# Altium project Laser MCU.PrjPcb (part 4 of 4)

## Sheet Communication.SchDoc
size 431 x 279 mm; Organization: ORGANIZATION; Address1: 207; Address2: 13399 104 Ave; Address3: Surrey BC, V3T 0C9; Address4: Canada; Revision: V0.0.0; SheetNumber: 5; SheetTotal: 5; ENG_APP_DATE: --/--/--; DSN_APP_DATE: --/--/--; CHK_APP_DATE: --/--/--
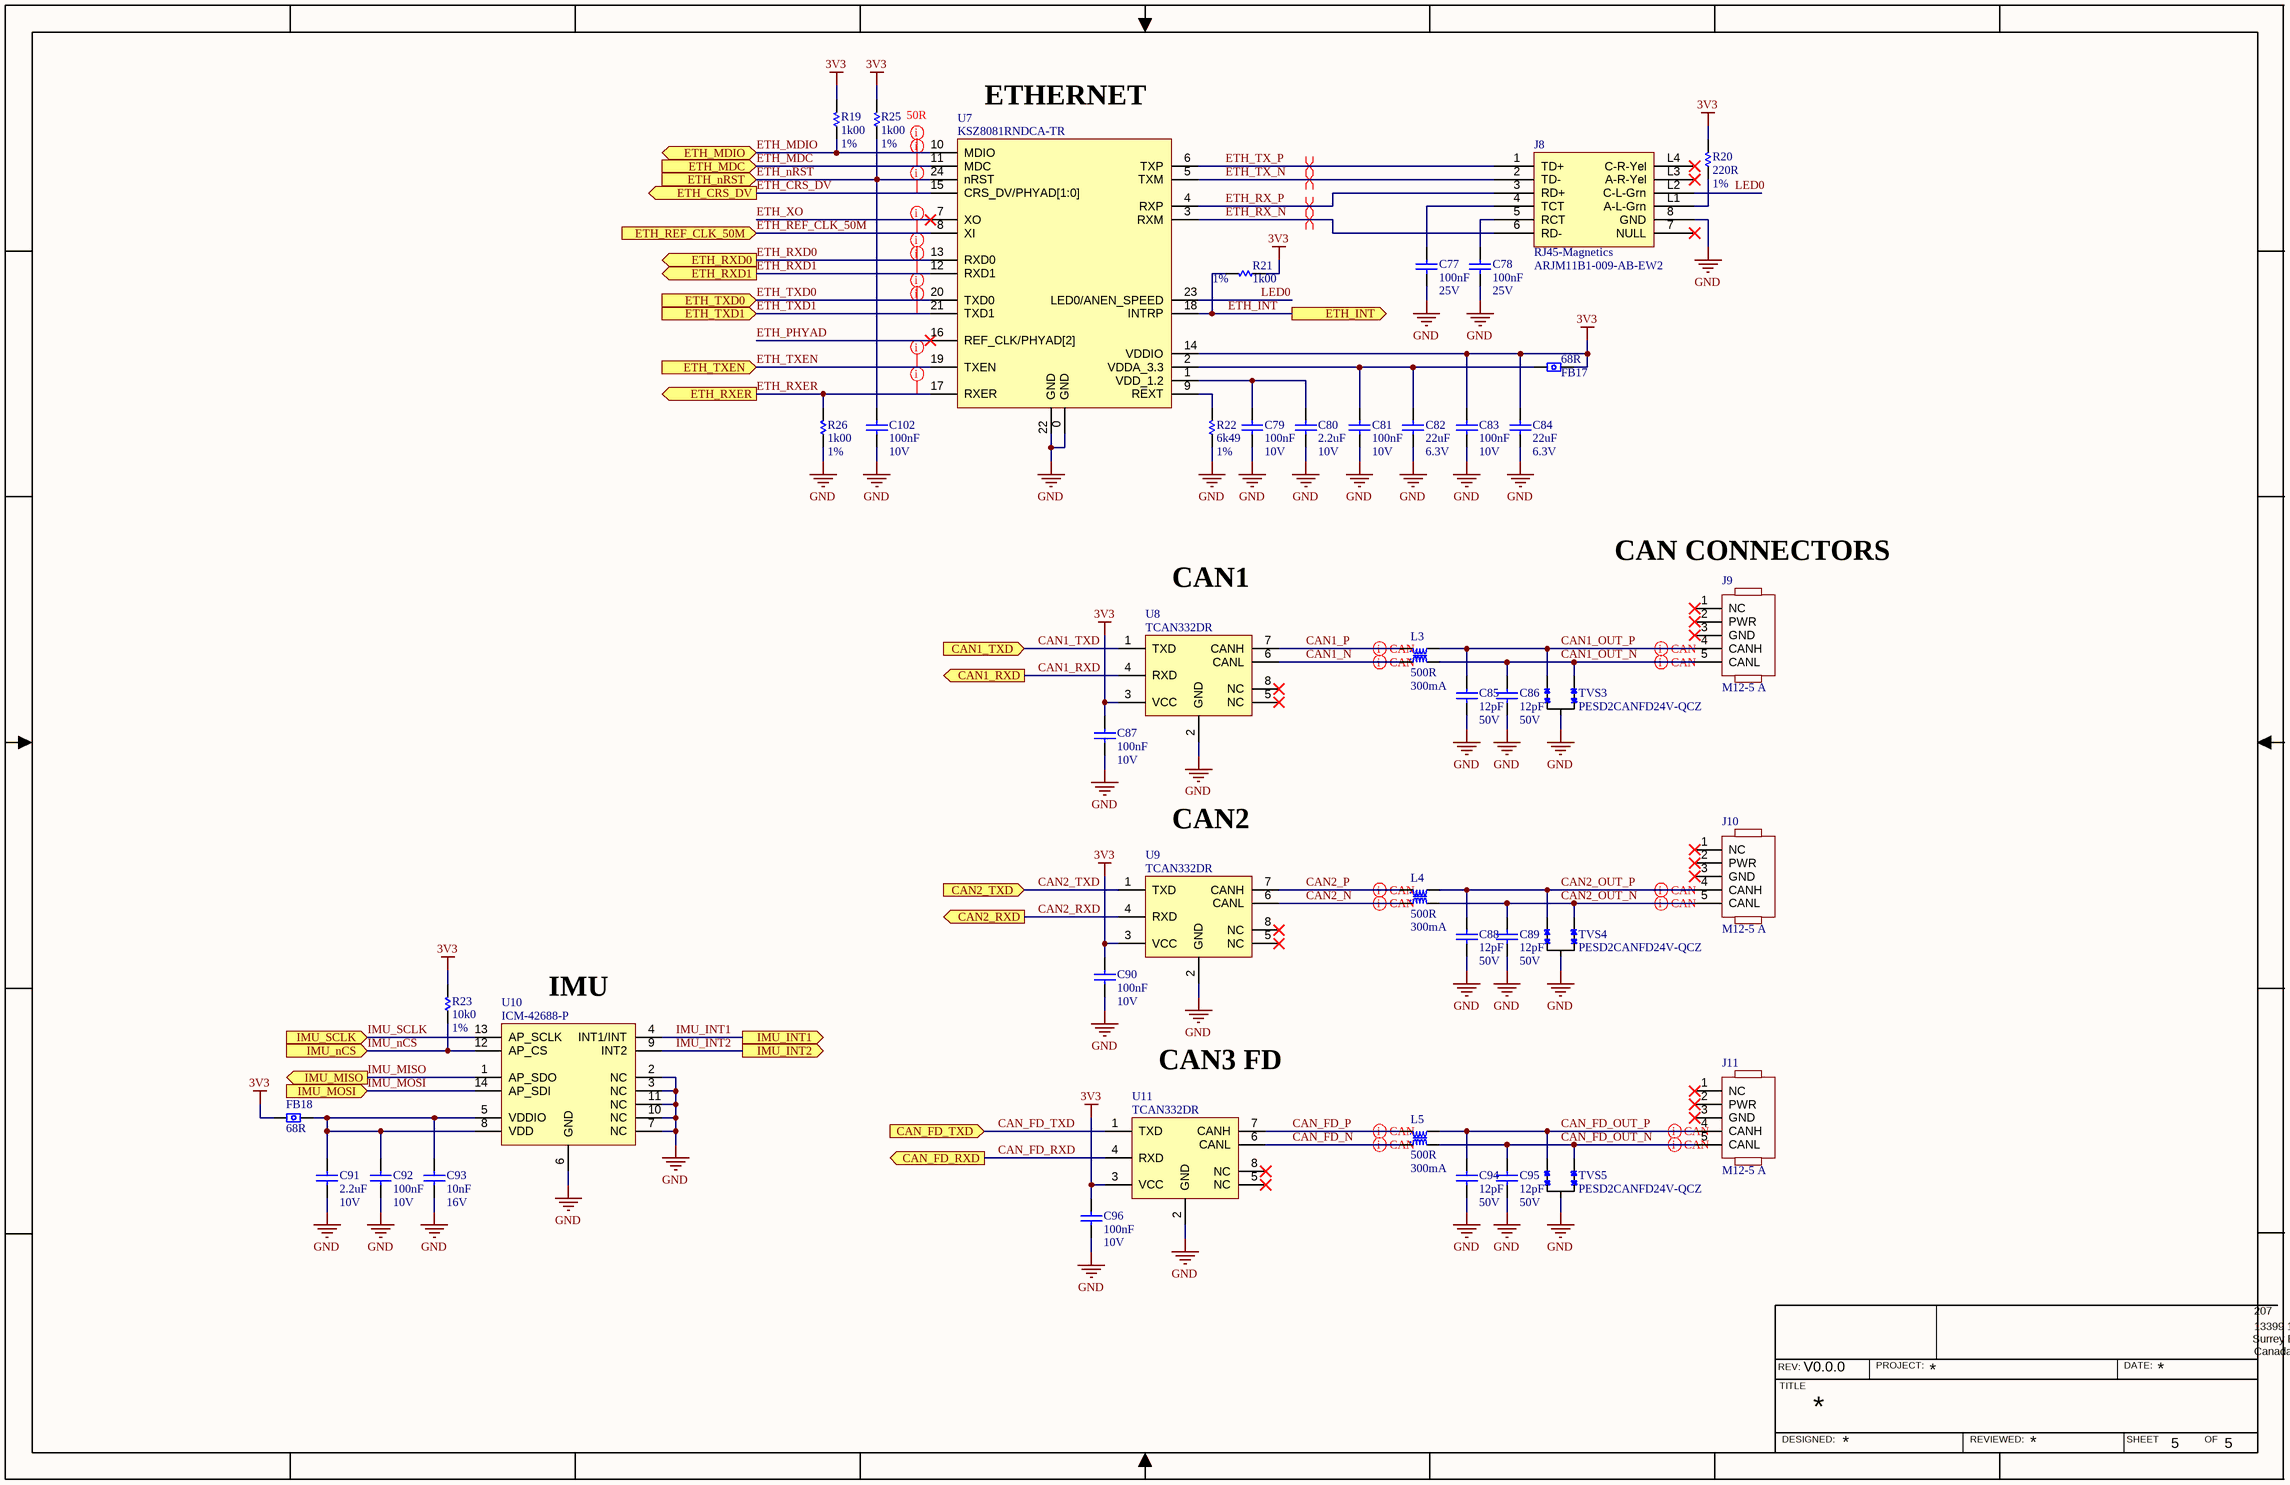
[diagram p4: Communication.SchDoc]

### Parts
C77  100nF  Voltage Rating: 25V  [C0402]
C78  100nF  Voltage Rating: 25V  [C0402]
C79  100nF  Voltage Rating: 10V  [C0201]
C80  2.2uF  Voltage Rating: 10V  [C0402]
C81  100nF  Voltage Rating: 10V  [C0201]
C82  22uF  Voltage Rating (DC): 6.3V  [C0805]
C83  100nF  Voltage Rating: 10V  [C0201]
C84  22uF  Voltage Rating (DC): 6.3V  [C0805]
C85  12pF  Voltage: 50V  [C0402]
C86  12pF  Voltage: 50V  [C0402]
C87  100nF  Voltage Rating: 10V  [C0201]
C88  12pF  Voltage: 50V  [C0402]
C89  12pF  Voltage: 50V  [C0402]
C90  100nF  Voltage Rating: 10V  [C0201]
C91  2.2uF  Voltage Rating: 10V  [C0402]
C92  100nF  Voltage Rating: 10V  [C0201]
C93  10nF  Voltage Rating: 16V  [c0402]
C94  12pF  Voltage: 50V  [C0402]
C95  12pF  Voltage: 50V  [C0402]
C96  100nF  Voltage Rating: 10V  [C0201]
C102  100nF  Voltage Rating: 10V  [C0201]
FB17  68R  [FB0402]
FB18  68R  [FB0402]
J8  RJ45-Magnetics  [RJ45_ARJM11B1_LED]
J9  M12-5 A  [M12-5A RA TH]
J10  M12-5 A  [M12-5A RA TH]
J11  M12-5 A  [M12-5A RA TH]
L3  500R  Max Current Rating: 300mA  [IND CHOKE 1.2x2]
L4  500R  Max Current Rating: 300mA  [IND CHOKE 1.2x2]
L5  500R  Max Current Rating: 300mA  [IND CHOKE 1.2x2]
R19  1k00  Tolerance: 1%  [R0402]
R20  220R  Tolerance: 1%  [R0402]
R21  1k00  Tolerance: 1%  [R0402]
R22  6k49  Tolerance: 1%  [r0402]
R23  10k0  Tolerance: 1%  [r0402]
R25  1k00  Tolerance: 1%  [R0402]
R26  1k00  Tolerance: 1%  [R0402]
TVS3  PESD2CANFD24V-QCZ  [DFN1412D-3]
TVS4  PESD2CANFD24V-QCZ  [DFN1412D-3]
TVS5  PESD2CANFD24V-QCZ  [DFN1412D-3]
U7  KSZ8081RNDCA-TR  [QFN50P400X400X90_HS-25N]
U8  TCAN332DR  [SO8 6.2x5mm TI D0008A]
U9  TCAN332DR  [SO8 6.2x5mm TI D0008A]
U10  ICM-42688-P  [PQFN50P300X250X97-14 ICM-42688-P]
U11  TCAN332DR  [SO8 6.2x5mm TI D0008A]

### Ports
CAN1_RXD (out), CAN1_TXD (in), CAN2_RXD (out), CAN2_TXD (in), CAN_FD_RXD (out), CAN_FD_TXD (in), ETH_CRS_DV (out), ETH_INT (out), ETH_MDC (in), ETH_MDIO (bidir), ETH_nRST (in), ETH_REF_CLK_50M (in), ETH_RXD0 (out), ETH_RXD1 (out), ETH_RXER (out), ETH_TXD0 (in), ETH_TXD1 (in), ETH_TXEN (in), IMU_INT1 (out), IMU_INT2 (out), IMU_MISO (out), IMU_MOSI (in), IMU_nCS (in), IMU_SCLK (in)

### Nets
3V3: C83.2 C84.2 C87.2 C90.2 C96.2 FB17.1 FB18.1 R19.2 R20.2 R21.1 R23.2 R25.2 U7.14(VDDIO) U8.3(VCC) U9.3(VCC) U11.3(VCC)
GND: C77.1 C78.1 C79.1 C80.1 C81.1 C82.1 C83.1 C84.1 C85.1 C86.1 C87.1 C88.1 C89.1 C90.1 C91.1 C92.1 C93.1 C94.1 C95.1 C96.1 C102.1 J8.8(GND) R22.1 R26.1 TVS3.3 TVS4.3 TVS5.3 U7.0(GND) U7.22(GND) U8.2(GND) U9.2(GND) U10.2(NC) U10.3(NC) U10.6(GND) U10.7(NC) U10.10(NC) U10.11(NC) U11.2(GND)
CAN1_N: L3.4 U8.6(CANL)
CAN1_OUT_N: C86.2 J9.5(CANL) L3.3 TVS3.2
CAN1_OUT_P: C85.2 J9.4(CANH) L3.2 TVS3.1
CAN1_P: L3.1 U8.7(CANH)
CAN1_RXD: U8.4(RXD) ; port CAN1_RXD
CAN1_TXD: U8.1(TXD) ; port CAN1_TXD
CAN2_N: L4.4 U9.6(CANL)
CAN2_OUT_N: C89.2 J10.5(CANL) L4.3 TVS4.2
CAN2_OUT_P: C88.2 J10.4(CANH) L4.2 TVS4.1
CAN2_P: L4.1 U9.7(CANH)
CAN2_RXD: U9.4(RXD) ; port CAN2_RXD
CAN2_TXD: U9.1(TXD) ; port CAN2_TXD
CAN_FD_N: L5.4 U11.6(CANL)
CAN_FD_OUT_N: C95.2 J11.5(CANL) L5.3 TVS5.2
CAN_FD_OUT_P: C94.2 J11.4(CANH) L5.2 TVS5.1
CAN_FD_P: L5.1 U11.7(CANH)
CAN_FD_RXD: U11.4(RXD) ; port CAN_FD_RXD
CAN_FD_TXD: U11.1(TXD) ; port CAN_FD_TXD
ETH_CRS_DV: U7.15(CRS_DV/PHYAD[1:0]) ; port ETH_CRS_DV
ETH_INT: R21.2 U7.18(INTRP) ; port ETH_INT
ETH_MDC: U7.11(MDC) ; port ETH_MDC
ETH_MDIO: R19.1 U7.10(MDIO) ; port ETH_MDIO
ETH_nRST: C102.2 R25.1 U7.24(nRST) ; port ETH_nRST
ETH_PHYAD: U7.16(REF_CLK/PHYAD[2])
ETH_REF_CLK_50M: U7.8(XI) ; port ETH_REF_CLK_50M
ETH_RX_N: J8.6(RD-) U7.3(RXM)
ETH_RX_P: J8.3(RD+) U7.4(RXP)
ETH_RXD0: U7.13(RXD0) ; port ETH_RXD0
ETH_RXD1: U7.12(RXD1) ; port ETH_RXD1
ETH_RXER: R26.2 U7.17(RXER) ; port ETH_RXER
ETH_TX_N: J8.2(TD-) U7.5(TXM)
ETH_TX_P: J8.1(TD+) U7.6(TXP)
ETH_TXD0: U7.20(TXD0) ; port ETH_TXD0
ETH_TXD1: U7.21(TXD1) ; port ETH_TXD1
ETH_TXEN: U7.19(TXEN) ; port ETH_TXEN
ETH_XO: U7.7(XO)
IMU_INT1: U10.4(INT1/INT) ; port IMU_INT1
IMU_INT2: U10.9(INT2) ; port IMU_INT2
IMU_MISO: U10.1(AP_SDO) ; port IMU_MISO
IMU_MOSI: U10.14(AP_SDI) ; port IMU_MOSI
IMU_nCS: R23.1 U10.12(AP_CS) ; port IMU_nCS
IMU_SCLK: U10.13(AP_SCLK) ; port IMU_SCLK
LED0: J8.L2(C-L-Grn) U7.23(LED0/ANEN_SPEED)
NetC77_2: C77.2 J8.4(TCT)
NetC78_2: C78.2 J8.5(RCT)
NetC79_2: C79.2 C80.2 U7.1(VDD_1.2)
NetC81_2: C81.2 C82.2 FB17.2 U7.2(VDDA_3.3)
NetC91_2: C91.2 C92.2 C93.2 FB18.2 U10.5(VDDIO) U10.8(VDD)
NetJ8_L1: J8.L1(A-L-Grn) R20.1
NetR22_2: R22.2 U7.9(REXT)

Not connected (* = marked no-connect by the designer): J8 7(NULL)* L3(A-R-Yel)* L4(C-R-Yel)*; J9 1(NC)* 2(PWR)* 3(GND)*; J10 1(NC)* 2(PWR)* 3(GND)*; J11 1(NC)* 2(PWR)* 3(GND)*; U8 5(NC)* 8(NC)*; U9 5(NC)* 8(NC)*; U11 5(NC)* 8(NC)*

### Layout directives
differential pair; net class CANFD: CAN_FD_N, CAN_FD_P
differential pair; net class ETH_MD; differential pair class ETH_TX; rule Matched Net Lengths [Tolerance = 50mm]; rule Matched Net Lengths [Tolerance = 0.25mm]; rule Impedance Constraint [Min = 42.50    Max = 57.50    ]; rule Impedance Constraint [Min = 85.00    Max = 115.0    ]: ETH_TX_N, ETH_TX_P
net class 50R ETH; rule Impedance Constraint [Min = 42.50    Max = 57.50    ]; rule Matched Net Lengths [Tolerance = 50mil]: ETH_CRS_DV, ETH_MDC, ETH_MDIO, ETH_RXD0, ETH_RXD1, ETH_RXER, ETH_TXD0, ETH_TXD1, ETH_TXEN
net class 50R ETH; rule Impedance Constraint [Min = 42.50    Max = 57.50    ]; rule Matched Net Lengths [Tolerance = 50mil]; rule Parallel Segment Constraint [Gap = 20mil    Limit = 1mil    Layer - Same Layer]: ETH_REF_CLK_50M
differential pair; net class ETH_MD; differential pair class ETH_RX; rule Matched Net Lengths [Tolerance = 50mm]; rule Matched Net Lengths [Tolerance = 0.25mm]; rule Impedance Constraint [Min = 42.50    Max = 57.50    ]; rule Impedance Constraint [Min = 85.00    Max = 115.0    ]: ETH_RX_N, ETH_RX_P
differential pair; net class CAN2: CAN2_N, CAN2_P
differential pair; net class CAN1: CAN1_N, CAN1_P
differential pair; net class CANFD_OUT: CAN_FD_OUT_N, CAN_FD_OUT_P
differential pair; net class CAN2_OUT: CAN2_OUT_N, CAN2_OUT_P
differential pair; net class CAN_OUT1: CAN1_OUT_N, CAN1_OUT_P

### Notes on the sheet
- (near U7) ETHERNET
- (near J9) CAN CONNECTORS
- CAN1
- CAN2
- (near U10) IMU
- CAN3 FD
- REV:
- PROJECT:
- DATE:
- TITLE
- SHEET
- OF
- DESIGNED:
- REVIEWED:

### Library data of the parts
C77 C78 = CAP CER 100nF 25V X5R 0402: Cap Ceramic 0.1uF 25V X5R 10% Pad SMD 0402 85¡ãC T/R / Multi Layer Ceramic Capacitor (MLCC); Manufacturer: Samsung; Manufacturer Part Number: CL05A104KA5NNNC; Supplier 1: Digi-Key; RoHS: Yes; Category: Ceramic Capacitors; Stock 1: 8053194; Pricing 1: 1=0.10000, 10=0.01100, 50=0.00600, 100=0.00490, 500=0.00346, 1000=0.00272, 2500=0.00248, 5000=0.00228 (USD); Mount: Surface Mount; Case/Package: 0402; Case Code (Metric): 1005; Case Code (Imperial): 0402; Min Operating Temperature: -55°C; Max Operating Temperature: 85°C; Capacitance: 100nF; Tolerance: 10%; Dielectric: X5R; Packaging: Tape and Reel; Package Quantity: 1; Voltage: 25V; Series: CL; Construction: Flat; Voltage Rating (DC): 25V; Length: 1mm; Width: 0.02inch; Height: 0.5mm; Thickness: 0.022inch; Depth: 0.5mm; Radiation Hardening: No; Lead Free: Lead Free; ComponentLink1URL: https://datasheet.ciiva.com/25802/cl05a104ka5nnnc-25802704.pdf?src-supplier=Digi-Key; ComponentLink1Description: https://datasheet.ciiva.com/25802/cl05a104ka5nnnc-25802704.pdf?src-supplier=Digi-Key; ComponentLink2URL: https://datasheet.ciiva.com/26838/getdatasheetpartid-357412-26838142.pdf?src-supplier=Verical; ComponentLink2Description: https://datasheet.ciiva.com/26838/getdatasheetpartid-357412-26838142.pdf?src-supplier=Verical; ComponentLink3URL: https://datasheet.ciiva.com/16437/cl05a104ka5nnnc-16437369.pdf?src-supplier=Future+Electronics; ComponentLink3Description: https://datasheet.ciiva.com/16437/cl05a104ka5nnnc-16437369.pdf?src-supplier=Future+Electronics; ComponentLink4URL: https://datasheet.ciiva.com/26309/mlcc-catalogdownload2013-eng-26309014.pdf?src-supplier=Distrelec; ComponentLink4Description: https://datasheet.ciiva.com/26309/mlcc-catalogdownload2013-eng-26309014.pdf?src-supplier=Distrelec; Supplier Part Number 1: 1276-1043-1-ND
C79 C81 C83 C87 C90 C92 C96 C102 = CAP CER 100nF 10V X5R 0201: CAP CER 0.1UF 10V X5R 0201; Manufacturer 1: Murata; Manufacturer Part Number 1: GRM033R61A104ME15D; Tolerance: 20%; Category 1: Ceramic Capacitors; Supplier 1: Newark; Stock 1: 345000; Pricing 1: 1=0.00300, 15000=0.00300 (USD); Case/Package: 0201; Case Code (Metric): 0603; Case Code (Imperial): 0201; Min Operating Temperature: -55°C; Max Operating Temperature: 85°C; Dielectric: X5R; Packaging: Tape and Reel; Package Quantity: 10; Series: GRM; Voltage Rating (DC): 10V; Length: 0.024inch; Width: 0.012inch; Thickness: 0.013inch; Depth: 0.3mm; Lead Free: Lead Free; ComponentLink1URL: https://datasheet.ciiva.com/131/partnumbering-e-01-131478.pdf?src-supplier=Digi-Key; ComponentLink1Description: https://datasheet.ciiva.com/131/partnumbering-e-01-131478.pdf?src-supplier=Digi-Key; ComponentLink2URL: https://datasheet.ciiva.com/131/partnumbering-e-01-131479.pdf?src-supplier=Digi-Key; ComponentLink2Description: https://datasheet.ciiva.com/131/partnumbering-e-01-131479.pdf?src-supplier=Digi-Key; Supplier Part Number 1: 65AH6960; RoHS 1: Yes; Description 1: CAP CER 0.1UF 10V X5R 0201; Mounting Technology: Surface Mount; Value: 100nF; RoHS Compliant: Yes
C80 C91 = CAP CER 2.2uF 10V X5R 0402: -; Manufacturer: Taiyo Yuden; Manufacturer Part Number: LMK105BJ225MV-F; Tolerance: 20%; Dielectric: X5R; Supplier 1: Newark; RoHS: Yes; Category: Ceramic Capacitors; Stock 1: 2002; Pricing 1: 1=0.10000, 25=0.03300, 100=0.02300, 250=0.02000, 500=0.01700, 1000=0.01500 (USD); Mount: Surface Mount; Case/Package: 0402; Case Code (Imperial): 0402; Case Code (Metric): 1005; Min Operating Temperature: -55°C; Max Operating Temperature: 85°C; Packaging: Tape and Reel; Capacitance: 2.2uF; Package Quantity: 1; Voltage Rating (DC): 10V; Termination: SMD/SMT; Series: M; Construction: Flat; Resistor Type: Ceramic; Length: 1mm; Width: 0.5mm; Height: 0.5mm; Thickness: 0.022inch; Depth: 0.5mm; Radiation Hardening: No; RoHS Compliant: Yes; REACH SVHC: Unknown; Halogen Free: Halogen Free; ComponentLink1URL: https://datasheet.ciiva.com/134/lmk105bj225mv-f-ss-134677.pdf?src-supplier=Digi-Key; ComponentLink1Description: https://datasheet.ciiva.com/134/lmk105bj225mv-f-ss-134677.pdf?src-supplier=Digi-Key; ComponentLink2URL: https://datasheet.ciiva.com/23631/lmk105bj225mv-f-ss-23631491.pdf?src-supplier=Newark; ComponentLink2Description: https://datasheet.ciiva.com/23631/lmk105bj225mv-f-ss-23631491.pdf?src-supplier=Newark; ComponentLink3URL: https://datasheet.ciiva.com/15921/286lmk105bj225mv-f-15921222.pdf?src-supplier=Onlinecomponents.com; ComponentLink3Description: https://datasheet.ciiva.com/15921/286lmk105bj225mv-f-15921222.pdf?src-supplier=Onlinecomponents.com; ComponentLink4URL: https://datasheet.ciiva.com/30190/500lmk105bj225mv-f-30190498.pdf?src-supplier=Onlinecomponents.com; ComponentLink4Description: https://datasheet.ciiva.com/30190/500lmk105bj225mv-f-30190498.pdf?src-supplier=Onlinecomponents.com; Supplier Part Number 1: 78T6311
C82 C84 = CAP CER 22uF 6.3V X5R 0805: CAP CER 22UF 6.3V X5R 0805 / Cap Ceramic 22uF 6.3V X5R 20% Pad SMD 0805 85¡ãC T/R; Manufacturer: Samsung; Manufacturer Part Number: CL21A226MQQNNNE; Supplier 1: Digi-Key; RoHS: Yes; Category: Ceramic Capacitors; Stock 1: 657907; Pricing 1: 1=0.14000, 10=0.10200, 50=0.05780, 100=0.04780, 500=0.03356, 1000=0.02778 (USD); Mount: Surface Mount; Case/Package: 0805; Case Code (Metric): 2012; Case Code (Imperial): 0805; Contact Plating: Tin; Min Operating Temperature: -55°C; Max Operating Temperature: 85°C; Capacitance: 22uF; Tolerance: 20%; Dielectric: X5R; Package Quantity: 2000; Packaging: Tape and Reel; Voltage Rating: 6.3V; Series: CL; Length: 0.079inch; Width: 0.049inch; Height: 1.25mm; Thickness: 0.055inch; Depth: 1.25mm; Radiation Hardening: No; Lead Free: Lead Free; RoHS Compliant: Yes; ComponentLink1URL: https://datasheet.ciiva.com/25796/cl21a226mqqnnne-25796195.pdf?src-supplier=Digi-Key; ComponentLink1Description: https://datasheet.ciiva.com/25796/cl21a226mqqnnne-25796195.pdf?src-supplier=Digi-Key; ComponentLink2URL: https://datasheet.ciiva.com/26838/getdatasheetpartid-357607-26838611.pdf?src-supplier=Verical; ComponentLink2Description: https://datasheet.ciiva.com/26838/getdatasheetpartid-357607-26838611.pdf?src-supplier=Verical; ComponentLink3URL: https://datasheet.ciiva.com/16361/cl21a226mqqnnne-16361189.pdf?src-supplier=Future+Electronics; ComponentLink3Description: https://datasheet.ciiva.com/16361/cl21a226mqqnnne-16361189.pdf?src-supplier=Future+Electronics; ComponentLink4URL: https://datasheet.ciiva.com/26787/cl21a226mqqnnne-26787006.pdf?src-supplier=IIIC; ComponentLink4Description: https://datasheet.ciiva.com/26787/cl21a226mqqnnne-26787006.pdf?src-supplier=IIIC; Supplier Part Number 1: 1276-1100-1-ND
C85 C86 C88 C89 C94 C95 = CAP CER 12pF 50V C0G 0402: Ceramic capacitor SMD-0402 12pF /50V C0G# J +-5%, Samsung, RoHS; Manufacturer Part Number: CL05C120JB5NNNC; Tolerance: 5%; Dielectric: C0G; Temperature Coefficient: 300ppm/°C; Supplier 1: Digi-Key; Manufacturer: Samsung; RoHS: Yes; Category: Ceramic Capacitors; Stock 1: 41998; Pricing 1: 10000=0.00386, 20000=0.00367 (USD); Mount: Surface Mount; Case/Package: 0402; Case Code (Metric): 1005; Case Code (Imperial): 0402; Material: Ceramic; Contact Plating: Tin; Min Operating Temperature: -55°C; Max Operating Temperature: 125°C; Capacitance: 12pF; Package Quantity: 1; Packaging: Tape and Reel; Voltage Rating: 50V; Series: CL; Construction: Flat; Voltage Rating (DC): 50V; Length: 1mm; Width: 0.02inch; Height: 0.5mm; Thickness: 0.022inch; Depth: 0.5mm; Radiation Hardening: No; RoHS Compliant: Yes; Lead Free: Lead Free; ComponentLink1URL: https://datasheet.ciiva.com/25806/cl05c120jb5nnnc-25806484.pdf?src-supplier=Digi-Key; ComponentLink1Description: https://datasheet.ciiva.com/25806/cl05c120jb5nnnc-25806484.pdf?src-supplier=Digi-Key; ComponentLink2URL: https://datasheet.ciiva.com/26838/getdatasheetpartid-658047-26838280.pdf?src-supplier=Verical; ComponentLink2Description: https://datasheet.ciiva.com/26838/getdatasheetpartid-658047-26838280.pdf?src-supplier=Verical; ComponentLink3URL: https://datasheet.ciiva.com/29198/458703-da-01-en-vs-kondensator-0402-29198421.pdf?src-supplier=Conrad; ComponentLink3Description: https://datasheet.ciiva.com/29198/458703-da-01-en-vs-kondensator-0402-29198421.pdf?src-supplier=Conrad; ComponentLink4URL: https://datasheet.ciiva.com/16449/cl05b104kq5nnnc-16449055.pdf?src-supplier=Future+Electronics; ComponentLink4Description: https://datasheet.ciiva.com/16449/cl05b104kq5nnnc-16449055.pdf?src-supplier=Future+Electronics; Supplier Part Number 1: 1276-1178-2-ND
C93 = CAP CER 10nF 16V Y5V 0402: 0402 10 nF 16 V -20 / +80 % Tolerance Y5V SMT Multilayer Ceramic Capacitor; Manufacturer: Yageo; Manufacturer Part Number: CC0402ZRY5V7BB103; Tolerance: 80%; Insulation Resistance: 100GR; Supplier 1: Future Electronics; RoHS: Yes; Category: Ceramic Capacitors; Stock 1: 10000; Pricing 1: 10000=0.00340, 30000=0.00320, 100000=0.00300, 200000=0.00290, 400000=0.00270 (USD); Mount: Surface Mount; Case/Package: 0402; Number of Pins: 2; Case Code (Imperial): 0402; Case Code (Metric): 1005; Dielectric Material: Ceramic; Min Operating Temperature: -55°C; Max Operating Temperature: 85°C; Capacitance: 10nF; Packaging: Tape and Reel; Voltage Rating (DC): 16V; Dielectric: Y5V; Termination: SMD/SMT; Series: CC; Package Quantity: 10000; Construction: Flat; Length: 1mm; Width: 0.02inch; Height: 0.5mm; Depth: 0.5mm; Thickness: 0.022inch; Terminal Length: 0.225mm; Radiation Hardening: No; RoHS Compliant: Yes; Lead Free: Lead Free; REACH SVHC: No SVHC; Halogen Free: Halogen Free; ComponentLink1URL: https://datasheet.ciiva.com/144/mlccorderingcode-144484.pdf?src-supplier=Digi-Key; ComponentLink1Description: https://datasheet.ciiva.com/144/mlccorderingcode-144484.pdf?src-supplier=Digi-Key; ComponentLink2URL: https://datasheet.ciiva.com/144/mlccorderingcode-144485.pdf?src-supplier=Digi-Key; ComponentLink2Description: https://datasheet.ciiva.com/144/mlccorderingcode-144485.pdf?src-supplier=Digi-Key; ComponentLink3URL: https://datasheet.ciiva.com/144/mlccorderingcode-144486.pdf?src-supplier=Digi-Key; ComponentLink3Description: https://datasheet.ciiva.com/144/mlccorderingcode-144486.pdf?src-supplier=Digi-Key; ComponentLink4URL: https://datasheet.ciiva.com/11586/upy-gphc-y5v-6-3v-to-50v-5-11586517.pdf?src-supplier=Avnet; ComponentLink4Description: https://datasheet.ciiva.com/11586/upy-gphc-y5v-6-3v-to-50v-5-11586517.pdf?src-supplier=Avnet; ComponentLink5URL: https://datasheet.ciiva.com/5789/1132289-5789565.pdf?src-supplier=Farnell; ComponentLink5Description: https://datasheet.ciiva.com/5789/1132289-5789565.pdf?src-supplier=Farnell; ComponentLink6URL: https://datasheet.ciiva.com/5789/1132289-5789566.pdf?src-supplier=Farnell; ComponentLink6Description: https://datasheet.ciiva.com/5789/1132289-5789566.pdf?src-supplier=Farnell; ComponentLink7URL: https://datasheet.ciiva.com/17437/upy-gphc-y5v-6-3v-to-50v-5-17437221.pdf?src-supplier=Avnet+Europe; ComponentLink7Description: https://datasheet.ciiva.com/17437/upy-gphc-y5v-6-3v-to-50v-5-17437221.pdf?src-supplier=Avnet+Europe; ComponentLink8URL: https://datasheet.ciiva.com/8033/1132289-8033641.pdf?src-supplier=Element14; ComponentLink8Description: https://datasheet.ciiva.com/8033/1132289-8033641.pdf?src-supplier=Element14; ComponentLink9URL: https://datasheet.ciiva.com/8033/1132289-8033642.pdf?src-supplier=Element14; ComponentLink9Description: https://datasheet.ciiva.com/8033/1132289-8033642.pdf?src-supplier=Element14; Supplier Part Number 1: 1300987
FB17 FB18 = FB 68R 400mA 310mR 0402: Ferrite Beads Multi-Layer 68Ohm 25% 100MHz 400mA 310mOhm DCR 0402 T/R; Manufacturer: Taiyo Yuden; Manufacturer Part Number: BK1005LL680-T; DC Resistance (DCR): 310mR; Number of Lines: 1; Shielding: Unshielded; Supplier 1: Digi-Key; RoHS: Yes; Category: Ferrite Beads and Chips; Stock 1: 9707; Pricing 1: 1=0.10000, 10=0.04100, 25=0.03640, 50=0.03300, 100=0.02970, 250=0.02176, 500=0.01584, 1000=0.01551, 5000=0.01056 (USD); Mount: Surface Mount; Case/Package: 0402; Number of Pins: 2; Case Code (Metric): 1005; Case Code (Imperial): 0402; Core Material: Ferrite; Min Operating Temperature: -55°C; Max Operating Temperature: 125°C; Packaging: Tape and Reel; Package Quantity: 1; Impedance: 68R; Tolerance: 25%; Max DC Current: 400mA; Termination: SMD/SMT; Test Frequency: 100MHz; Max Current Rating: 400mA; Series: BK; Frequency: 100MHz; Length: 0.039inch; Width: 0.02inch; Height: 0.022inch; Depth: 0.55mm; Halogen Free: Halogen Free; Lead Free: Lead Free; REACH SVHC: Unknown; ComponentLink1URL: https://datasheet.ciiva.com/1013/bk1005ll680-t-ss-1013936.pdf?src-supplier=Digi-Key; ComponentLink1Description: https://datasheet.ciiva.com/1013/bk1005ll680-t-ss-1013936.pdf?src-supplier=Digi-Key; ComponentLink2URL: https://datasheet.ciiva.com/1013/mlci07-e-1013935.pdf?src-supplier=Digi-Key; ComponentLink2Description: https://datasheet.ciiva.com/1013/mlci07-e-1013935.pdf?src-supplier=Digi-Key; ComponentLink3URL: https://datasheet.ciiva.com/1013/mlci07-e-1013937.pdf?src-supplier=Digi-Key; ComponentLink3Description: https://datasheet.ciiva.com/1013/mlci07-e-1013937.pdf?src-supplier=Digi-Key; Supplier Part Number 1: 587-1860-1-ND
J8 = ARJM11B1-009-AB-EW2: RJ45 Integrated T-Base 100 Magnetics; Manufacturer 1: Abracon; Supplier 1: Avnet; Manufacturer Part Number 1: ARJM11B1-009-AB-EW2; Stock 1: 20; Pricing 1: 700=1.84854, 1400=1.79720, 2800=1.74862, 4200=1.70261, 7000=1.65895 (USD); RoHS: No; Supplier Part Number 1: ARJM11B1-009-AB-EW2
J9-J11 = CON M12-5A T4144015051-000: Connector, Circular, Plug, 5 Position, Right Angle, Panel Mount; Manufacturer: TE Connectivity AMP; Supplier 1: Newark; Manufacturer Part Number: T4144015051-000; RoHS: No; Stock 1: 29; Pricing 1: 1=19.94000, 10=16.94000, 25=16.15000, 50=15.83000, 100=14.59000, 250=13.35000 (USD); Supplier Part Number 1: 54AH7375
L3-L5 = IND CM 500R 300mA SRF2012-501YA: Common Mode Chokes Dual 500Ohm 100MHz 300mA 500mOhm DCR SMD T/R; Manufacturer: Bourns; Number of Lines: 2; DC Resistance (DCR): 500mR; Voltage Rating (DC): 50V; Supplier 1: Mouser; Manufacturer Part Number: SRF2012-501YA; RoHS: Yes; Category: Inductors; Stock 1: 13608; Pricing 1: 1=0.43000, 10=0.39000, 50=0.39000, 100=0.26900, 1000=0.17600, 10000=0.14900 (USD); Mount: Surface Mount; Min Operating Temperature: -40°C; Max Operating Temperature: 125°C; Package Quantity: 2000; Length: 0.079inch; Width: 0.047inch; Height: 0.055inch; RoHS Compliant: Yes; ComponentLink1URL: http://www.bourns.com/docs/Product-Datasheets/SRF2012A.pdf?src-supplier=Digi-Key; ComponentLink1Description: http://www.bourns.com/docs/Product-Datasheets/SRF2012A.pdf?src-supplier=Digi-Key; Supplier Part Number 1: 652-SRF2012-501YA
R19 R21 R25 R26 = RES 1k00 63mW 0402: 1 kOhms ¡À1% 0.063W, 1/16W Chip Resistor 0402 (1005 Metric) Moisture Resistant Thick Film; Manufacturer: Yageo; Manufacturer Part Number: RC0402FR-071KL; Resistance: 1kR; Temperature Coefficient: 100ppm/°C; Power Rating: 62.5mW; Voltage Rating: 50V; Max Power Dissipation: 63mW; Supplier 1: Newark; RoHS: Yes; Category: Chip SMD Resistors; Stock 1: 3520000; Pricing 1: 1=0.00100, 10000=0.00100 (USD); Case/Package: 0402; Number of Pins: 2; Case Code (Imperial): 0402; Case Code (Metric): 1005; Size Code: 0402; Min Operating Temperature: -55°C; Max Operating Temperature: 155°C; Resistor Type: Thick Film; Packaging: Tape and Reel; Voltage Rating (DC): 50V; Termination: SMD/SMT; Features: Moisture Resistant; Series: RC; Number of Terminations: 2; Resistance Tolerance: 1%; Construction: Rectangular; Technology: THICK FILM; Length: 1mm; Width: 0.5mm; Height: 0.32mm; Depth: 0.5mm; RoHS Compliant: Yes; Reach SVHC Compliant: Yes; Military Standard: Not; Lead Free: Lead Free; ComponentLink1URL: https://datasheet.ciiva.com/11819/0900766b80c66297-11819477.pdf?src-supplier=RSComponents; ComponentLink1Description: https://datasheet.ciiva.com/11819/0900766b80c66297-11819477.pdf?src-supplier=RSComponents; ComponentLink2URL: https://datasheet.ciiva.com/7983/1018594-7983502.pdf?src-supplier=Element14; ComponentLink2Description: https://datasheet.ciiva.com/7983/1018594-7983502.pdf?src-supplier=Element14; ComponentLink3URL: https://datasheet.ciiva.com/22747/1018594-22747513.pdf?src-supplier=Element14; ComponentLink3Description: https://datasheet.ciiva.com/22747/1018594-22747513.pdf?src-supplier=Element14; ComponentLink4URL: https://datasheet.ciiva.com/12666/pyu-rc0402-51-rohs-l-6-r-12666741.pdf?src-supplier=Mouser; ComponentLink4Description: https://datasheet.ciiva.com/12666/pyu-rc0402-51-rohs-l-6-r-12666741.pdf?src-supplier=Mouser; ComponentLink5URL: https://datasheet.ciiva.com/7849/1018594-7849869.pdf?src-supplier=Element14; ComponentLink5Description: https://datasheet.ciiva.com/7849/1018594-7849869.pdf?src-supplier=Element14; ComponentLink6URL: https://datasheet.ciiva.com/7849/1018594-7849871.pdf?src-supplier=Element14; ComponentLink6Description: https://datasheet.ciiva.com/7849/1018594-7849871.pdf?src-supplier=Element14; ComponentLink7URL: https://datasheet.ciiva.com/17063/pyu-rc0402-51-rohs-l-6-r-17063193.pdf?src-supplier=Future+Electronics; ComponentLink7Description: https://datasheet.ciiva.com/17063/pyu-rc0402-51-rohs-l-6-r-17063193.pdf?src-supplier=Future+Electronics; Supplier Part Number 1: 48Y4534
R20 = RES 220R 1% 63mW 0402: Res Thick Film 0402 220 Ohm 1% 0.063W ?100ppm/?C Molded SMD Paper T/R; Manufacturer: Yageo; Manufacturer Part Number: RC0402FR-07220RL; Power Rating: 62.5mW; Voltage Rating: 50V; Temperature Coefficient: 100ppm/°C; Max Power Dissipation: 63mW; Supplier 1: Future Electronics; RoHS: Yes; Category: Chip SMD Resistors; Stock 1: 4360000; Pricing 1: 10000=0.00100, 100000=0.00090, 300000=0.00090, 1250000=0.00090, 3000000=0.00080 (USD); Case/Package: 0402; Number of Pins: 2; Case Code (Imperial): 0402; Case Code (Metric): 1005; Size Code: 0402; Min Operating Temperature: -55°C; Max Operating Temperature: 155°C; Resistance: 220R; Packaging: Tape and Reel; Voltage Rating (DC): 50V; Package Quantity: 1; Termination: SMD/SMT; Resistor Type: Thick Film; Number of Terminations: 2; Features: Moisture Resistant; Series: RC; Resistance Tolerance: 1%; Construction: Rectangular; Technology: THICK FILM; Length: 0.039inch; Width: 0.02inch; Height: 0.016inch; Depth: 0.5mm; Reach SVHC Compliant: Yes; Military Standard: Not; Lead Free: Lead Free; RoHS Compliant: Yes; ComponentLink1URL: https://datasheet.ciiva.com/2453/pyu-r-int-thick-7-2453461.pdf?src-supplier=Digi-Key; ComponentLink1Description: https://datasheet.ciiva.com/2453/pyu-r-int-thick-7-2453461.pdf?src-supplier=Digi-Key; ComponentLink2URL: https://datasheet.ciiva.com/2453/pyu-r-int-thick-7-2453462.pdf?src-supplier=Digi-Key; ComponentLink2Description: https://datasheet.ciiva.com/2453/pyu-r-int-thick-7-2453462.pdf?src-supplier=Digi-Key; ComponentLink3URL: https://datasheet.ciiva.com/2453/pyu-r-int-thick-7-2453460.pdf?src-supplier=Digi-Key; ComponentLink3Description: https://datasheet.ciiva.com/2453/pyu-r-int-thick-7-2453460.pdf?src-supplier=Digi-Key; ComponentLink4URL: https://datasheet.ciiva.com/16746/pyu-rc0402-51-rohs-l-6-r-16746831.pdf?src-supplier=Future+Electronics; ComponentLink4Description: https://datasheet.ciiva.com/16746/pyu-rc0402-51-rohs-l-6-r-16746831.pdf?src-supplier=Future+Electronics; Supplier Part Number 1: 4696860
R22 = RES 6k49 1% 63mW 0402: Res Thick Film 0402 6.49K Ohm 1% 1/10W ±100ppm/°C Molded SMD Punched Carrier T/R; Manufacturer: Panasonic; Manufacturer Part Number: ERJ-2RKF6491X; Resistance: 6.49kR; Voltage Rating: 50V; Power Rating: 100mW; Supplier 1: Rs; RoHS: Yes; Category: Chip SMD Resistors; Stock 1: 40000; Pricing 1: 10000=0.00400 (GBP); Mount: Surface Mount; Case/Package: 0402; Case Code (Metric): 1005; Case Code (Imperial): 0402; Contact Plating: Tin; Min Operating Temperature: -55°C; Max Operating Temperature: 155°C; Packaging: Tape and Reel; Package Quantity: 10000; Resistor Type: Thick Film; Number of Terminations: 2; Termination: SMD/SMT; Temperature Coefficient: 100ppm/°C; Max Power Dissipation: 100mW; Voltage Rating (DC): 50V; Series: ERJ; Construction: Rectangular; Resistance Tolerance: 1%; Length: 1mm; Width: 0.02inch; Height: 0.016inch; Depth: 0.5mm; Reach SVHC Compliant: Unknown; Military Standard: Not; Lead Free: Lead Free; RoHS Compliant: Yes; ComponentLink1URL: https://datasheet.ciiva.com/43467/1678782-43467386.pdf?src-supplier=Farnell; ComponentLink1Description: https://datasheet.ciiva.com/43467/1678782-43467386.pdf?src-supplier=Farnell; ComponentLink2URL: https://datasheet.ciiva.com/24027/aoa0000ce2-24027007.pdf?src-supplier=Mouser; ComponentLink2Description: https://datasheet.ciiva.com/24027/aoa0000ce2-24027007.pdf?src-supplier=Mouser; ComponentLink3URL: https://datasheet.ciiva.com/28563/1694929-28563462.pdf?src-supplier=Element14; ComponentLink3Description: https://datasheet.ciiva.com/28563/1694929-28563462.pdf?src-supplier=Element14; ComponentLink4URL: https://datasheet.ciiva.com/9195/aoa0000ce2-9195022.pdf?src-supplier=Avnet; ComponentLink4Description: https://datasheet.ciiva.com/9195/aoa0000ce2-9195022.pdf?src-supplier=Avnet; ComponentLink5URL: https://datasheet.ciiva.com/30175/aoa0000ce2-30175391.pdf?src-supplier=Onlinecomponents.com; ComponentLink5Description: https://datasheet.ciiva.com/30175/aoa0000ce2-30175391.pdf?src-supplier=Onlinecomponents.com; ComponentLink6URL: https://datasheet.ciiva.com/46373/1678782-46373019.pdf?src-supplier=Element14; ComponentLink6Description: https://datasheet.ciiva.com/46373/1678782-46373019.pdf?src-supplier=Element14; ComponentLink7URL: https://datasheet.ciiva.com/46373/1678782-46373020.pdf?src-supplier=Element14; ComponentLink7Description: https://datasheet.ciiva.com/46373/1678782-46373020.pdf?src-supplier=Element14; ComponentLink8URL: https://datasheet.ciiva.com/7829/1678782-7829307.pdf?src-supplier=Element14; ComponentLink8Description: https://datasheet.ciiva.com/7829/1678782-7829307.pdf?src-supplier=Element14; ComponentLink9URL: https://datasheet.ciiva.com/16773/70260748-16773933.pdf?src-supplier=Allied+Electronics; ComponentLink9Description: https://datasheet.ciiva.com/16773/70260748-16773933.pdf?src-supplier=Allied+Electronics; ComponentLink10URL: https://datasheet.ciiva.com/16783/70260748-16783709.pdf?src-supplier=Allied+Electronics; ComponentLink10Description: https://datasheet.ciiva.com/16783/70260748-16783709.pdf?src-supplier=Allied+Electronics; ComponentLink11URL: https://datasheet.ciiva.com/22668/1678782-22668661.pdf?src-supplier=Element14; ComponentLink11Description: https://datasheet.ciiva.com/22668/1678782-22668661.pdf?src-supplier=Element14; Supplier Part Number 1: 1051117
R23 = RES 10k0 1% 63mW 0402: Res General Purpose Thick Film 0402 10K Ohm 1% 1/16W ±100ppm/°C Molded SMD Paper T/R; Manufacturer: Yageo; Manufacturer Part Number: RC0402FR-0710KL; Resistance: 10kR; Voltage Rating (DC): 50V; Power Rating: 62.5mW; Max Power Dissipation: 63mW; Supplier 1: RSComponents; RoHS: Yes; Category: Chip SMD Resistors; Stock 1: 29900; Pricing 1: 10000=0.00300 (GBP); Case/Package: 0402; Number of Pins: 2; Case Code (Imperial): 0402; Case Code (Metric): 1005; Min Operating Temperature: -55°C; Max Operating Temperature: 155°C; Resistor Type: Thick Film; Temperature Coefficient: 100ppm/°C; Packaging: Tape and Reel; Voltage Rating: 50V; Termination: SMD/SMT; Working Voltage: 50V; Number of Terminations: 2; Features: Moisture Resistant; Series: RC; Resistance Tolerance: 1%; Construction: Rectangular; Length: 1mm; Width: 0.5mm; Height: 0.32mm; Depth: 0.5mm; Lead Pitch: 0.2mm; REACH SVHC: No SVHC; Lead Free: Lead Free; RoHS Compliant: Yes; Military Standard: Not; ComponentLink1URL: https://datasheet.ciiva.com/7660/38568-7660787.pdf?src-supplier=Element14; ComponentLink1Description: https://datasheet.ciiva.com/7660/38568-7660787.pdf?src-supplier=Element14; ComponentLink2URL: https://datasheet.ciiva.com/12667/pyu-rc0402-51-rohs-l-6-r-12667067.pdf?src-supplier=Mouser; ComponentLink2Description: https://datasheet.ciiva.com/12667/pyu-rc0402-51-rohs-l-6-r-12667067.pdf?src-supplier=Mouser; ComponentLink3URL: https://datasheet.ciiva.com/7849/1784430-7849813.pdf?src-supplier=Element14; ComponentLink3Description: https://datasheet.ciiva.com/7849/1784430-7849813.pdf?src-supplier=Element14; ComponentLink4URL: https://datasheet.ciiva.com/7849/1686128-7849814.pdf?src-supplier=Element14; ComponentLink4Description: https://datasheet.ciiva.com/7849/1686128-7849814.pdf?src-supplier=Element14; ComponentLink5URL: https://datasheet.ciiva.com/7849/1784430-7849815.pdf?src-supplier=Element14; ComponentLink5Description: https://datasheet.ciiva.com/7849/1784430-7849815.pdf?src-supplier=Element14; ComponentLink6URL: https://datasheet.ciiva.com/7983/1018594-7983486.pdf?src-supplier=Element14; ComponentLink6Description: https://datasheet.ciiva.com/7983/1018594-7983486.pdf?src-supplier=Element14; ComponentLink7URL: https://datasheet.ciiva.com/22747/1018594-22747512.pdf?src-supplier=Element14; ComponentLink7Description: https://datasheet.ciiva.com/22747/1018594-22747512.pdf?src-supplier=Element14; Supplier Part Number 1: 1987643
TVS3-TVS5 = DIODE TVS 24V 2chanPESD2CANFD24V-QCZ: PESD2CANFD24V-QC - ESD protection for In-vehicle networks; Manufacturer: Nexperia; Supplier 1: Future Electronics; Manufacturer Part Number: PESD2CANFD24V-QCZ; RoHS: No; Category: TVS Diodes; Stock 1: 10000; Pricing 1: 5000=0.08170, 10000=0.07970, 20000=0.07780, 25000=0.07720, 75000=0.07350 (USD); Supplier Part Number 1: 8160273
U7 = IC ETH PHY 10-100M RMII KSZ8081RNDCATR: Ethernet PHY, 100Mbps, -40 to 85°C, VQFN-24, RoHS; Manufacturer: Microchip; Number of Channels: 1; Operating Supply Voltage: 3.3V; Min Supply Voltage: 3.135V; Max Supply Voltage: 3.465V; Max Supply Current: 47mA; Simplex/Duplex: Full Duplex; Supplier 1: Mouser; Manufacturer Part Number: KSZ8081RNDCATR; RoHS: Yes; Category: Ethernet Interface ICs; Stock 1: 40785; Pricing 1: 1=1.46000, 10=1.46000, 50=1.33000, 100=1.33000, 1000=1.31000, 10000=1.31000 (USD); Mount: Surface Mount; Case/Package: QFN; Number of Pins: 24; Min Operating Temperature: 0°C; Max Operating Temperature: 70°C; Packaging: Tape and Reel; Data Rate: 100Mbps; Package Quantity: 1000; Number of Transceivers: 1; Series: -; Length: 4mm; Width: 4mm; Height: 0.83mm; Reach SVHC Compliant: Yes; Lead Free: Lead Free; RoHS Compliant: Yes; ComponentLink1URL: https://datasheet.ciiva.com/6635/ksz8081rna-rnd-6635258.pdf?src-supplier=Digi-Key; ComponentLink1Description: https://datasheet.ciiva.com/6635/ksz8081rna-rnd-6635258.pdf?src-supplier=Digi-Key; ComponentLink2URL: https://datasheet.ciiva.com/16458/ksz8081rna-rnd-16458395.pdf?src-supplier=Future+Electronics; ComponentLink2Description: https://datasheet.ciiva.com/16458/ksz8081rna-rnd-16458395.pdf?src-supplier=Future+Electronics; Supplier Part Number 1: 998-KSZ8081RNDCATR
U8 U9 U11 = IC CAN TRX TCAN332DR: IC TXRX CAN 3.3V 8SOIC; Manufacturer: Texas Instruments; Data Rate: 1Mbps; Number of Transmit Buffers: 1; Min Supply Voltage: 3V; Max Supply Voltage: 3.6V; Receiver Hysteresis: 120mV; Supplier 1: Arrow Electronics; Manufacturer Part Number: TCAN332DR; RoHS: Yes; Category: Interface ICs; Stock 1: 1424; Pricing 1: 1=3.09860, 10=2.71410, 25=2.59680, 100=2.24690, 250=2.11310, 500=1.92950, 1000=1.75850 (USD); Mount: Surface Mount; Case/Package: SOIC; Number of Pins: 8; Min Operating Temperature: -40°C; Max Operating Temperature: 125°C; Packaging: Cut Tape; Number of Receive Buffers: 1; Series: -; Reach SVHC Compliant: Yes; Lead Free: Lead Free; RoHS Compliant: Yes; ComponentLink1URL: http://www.ti.com/general/docs/lit/getliterature.tsp?genericPartNumber=TCAN332&amp;&amp;fileType=pdf&src-supplier=Farnell; ComponentLink1Description: http://www.ti.com/general/docs/lit/getliterature.tsp?genericPartNumber=TCAN332&amp;&amp;fileType=pdf&src-supplier=Farnell; ComponentLink2URL: http://www.ti.com/general/docs/lit/getliterature.tsp?genericPartNumber=TCAN332&&fileType=pdf&src-supplier=Element14; ComponentLink2Description: http://www.ti.com/general/docs/lit/getliterature.tsp?genericPartNumber=TCAN332&&fileType=pdf&src-supplier=Element14; ComponentLink3URL: http://www.ti.com/lit/ds/symlink/tcan332.pdf?src-supplier=Digi-Key; ComponentLink3Description: http://www.ti.com/lit/ds/symlink/tcan332.pdf?src-supplier=Digi-Key; ComponentLink4URL: http://www.ti.com/lit/gpn/tcan332?src-supplier=Mouser; ComponentLink4Description: http://www.ti.com/lit/gpn/tcan332?src-supplier=Mouser; Supplier Part Number 1: TCAN332DR
U10 = IC IMU 6DOF ICM-42688-P: Accelerometer and Gyroscope 6-Axis MEMS Motion Tracking Device Digital-OUT 14-Pin LGA T/R; Manufacturer: TDK InvenSense; Sensor Type: Accelerometer,Gyroscope,6 Axis; Supplier 1: Rs; Manufacturer Part Number: ICM-42688-P; RoHS: No; Category: Inertial Measurement Units (IMUs); Stock 1: 98; Pricing 1: 2=7.49000, 100=4.73500, 500=3.73000, 1000=3.61000, 2500=3.49000 (GBP); Series: -; ComponentLink1URL: https://media.digikey.com/pdf/Data%20Sheets/TDK%20PDFs/ICM-42688-P_DS_Rev1.2.pdf?src-supplier=Digi-Key; ComponentLink1Description: https://media.digikey.com/pdf/Data%20Sheets/TDK%20PDFs/ICM-42688-P_DS_Rev1.2.pdf?src-supplier=Digi-Key; Supplier Part Number 1: 2182218

## Nets that join several sheets
3V3: Top_Level (J4.1 J5.1), External Memory (C18.2 FB1.2 R8.2 U4.8), MCU (23 pins), USB_AND_POWER (14 pins), Communication (16 pins)
GND: Top_Level (16 pins), External Memory (17 pins), MCU (80 pins), USB_AND_POWER (27 pins), Communication (38 pins)
ADC1_0: Top_Level (J2.1), MCU (U6.J13)
ADC1_7: Top_Level (J3.1), MCU (U6.L11)
ADC1_8: Top_Level (J5.4), MCU (U6.M12)
ADC2_1: Top_Level (J1.1), MCU (U6.H12)
ADC2_2: Top_Level (J5.5), MCU (U6.H11)
ADC2_3: Top_Level (J5.8), MCU (U6.G12)
CAN1_RXD: MCU (U6.M4), Communication (U8.4)
CAN1_TXD: MCU (U6.M3), Communication (U8.1)
CAN2_RXD: MCU (U6.G11), Communication (U9.4)
CAN2_TXD: MCU (U6.M11), Communication (U9.1)
CAN_FD_RXD: MCU (U6.L10), Communication (U11.4)
CAN_FD_TXD: MCU (U6.H14), Communication (U11.1)
DAC_MOSI: Top_Level (J4.2), MCU (U6.P3)
DAC_nCS: Top_Level (J4.3), MCU (U6.L3)
DAC_SCLK: Top_Level (J4.5), MCU (U6.L4)
ETH_CRS_DV: MCU (U6.D9), Communication (U7.15)
ETH_INT: MCU (U6.D8), Communication (R21.2 U7.18)
ETH_MDC: MCU (U6.D7), Communication (U7.11)
ETH_MDIO: MCU (U6.E7), Communication (R19.1 U7.10)
ETH_nRST: MCU (U6.D14), Communication (C102.2 R25.1 U7.24)
ETH_REF_CLK_50M: MCU (U6.E11), Communication (U7.8)
ETH_RXD0: MCU (U6.B11), Communication (U7.13)
ETH_RXD1: MCU (U6.C11), Communication (U7.12)
ETH_RXER: MCU (U6.A11), Communication (R26.2 U7.17)
ETH_TXD0: MCU (U6.C14), Communication (U7.20)
ETH_TXD1: MCU (U6.D10), Communication (U7.21)
ETH_TXEN: MCU (U6.E10), Communication (U7.19)
extFLASH_CLK: External Memory (U4.6), MCU (U6.P2)
extFLASH_IO0: External Memory (U4.5), MCU (U6.K10)
extFLASH_IO1: External Memory (U4.2), MCU (U6.J12)
extFLASH_IO2: External Memory (U4.3), MCU (U6.M5)
extFLASH_IO3: External Memory (U4.7), MCU (U6.L5)
extFLASH_nCS: External Memory (R8.1 U4.1), MCU (U6.J3)
extRAM_A0: External Memory (U5.H7), MCU (U6.C2)
extRAM_A1: External Memory (U5.H8), MCU (U6.G1)
extRAM_A2: External Memory (U5.J8), MCU (U6.G3)
extRAM_A3: External Memory (U5.J7), MCU (U6.H1)
extRAM_A4: External Memory (U5.J3), MCU (U6.A6)
extRAM_A5: External Memory (U5.J2), MCU (U6.B6)
extRAM_A6: External Memory (U5.H3), MCU (U6.B1)
extRAM_A7: External Memory (U5.H2), MCU (U6.A5)
extRAM_A8: External Memory (U5.H1), MCU (U6.A4)
extRAM_A9: External Memory (U5.G3), MCU (U6.B2)
extRAM_A10: External Memory (U5.H9), MCU (U6.G2)
extRAM_A11: External Memory (U5.G2), MCU (U6.B4)
extRAM_BA0: External Memory (U5.G7), MCU (U6.C1)
extRAM_BA1: External Memory (U5.G8), MCU (U6.F1)
extRAM_CKE: External Memory (U5.F3), MCU (U6.A2)
extRAM_CLK: External Memory (U5.F2), MCU (U6.B3)
extRAM_DM0: External Memory (U5.E8), MCU (U6.H3)
extRAM_DM1: External Memory (U5.F1), MCU (U6.D6)
extRAM_DQ0: External Memory (U5.A8), MCU (U6.E3)
extRAM_DQ1: External Memory (U5.B9), MCU (U6.F3)
extRAM_DQ2: External Memory (U5.B8), MCU (U6.F4)
extRAM_DQ3: External Memory (U5.C9), MCU (U6.G4)
extRAM_DQ4: External Memory (U5.C8), MCU (U6.F2)
extRAM_DQ5: External Memory (U5.D9), MCU (U6.G5)
extRAM_DQ6: External Memory (U5.D8), MCU (U6.H5)
extRAM_DQ7: External Memory (U5.E9), MCU (U6.H4)
extRAM_DQ8: External Memory (U5.E1), MCU (U6.C6)
extRAM_DQ9: External Memory (U5.D2), MCU (U6.C5)
extRAM_DQ10: External Memory (U5.D1), MCU (U6.D5)
extRAM_DQ11: External Memory (U5.C2), MCU (U6.C4)
extRAM_DQ12: External Memory (U5.C1), MCU (U6.D4)
extRAM_DQ13: External Memory (U5.B2), MCU (U6.E5)
extRAM_DQ14: External Memory (U5.B1), MCU (U6.C3)
extRAM_DQ15: External Memory (U5.A2), MCU (U6.E4)
extRAM_nCAS: External Memory (U5.F7), MCU (U6.D3)
extRAM_nCS: External Memory (U5.G9), MCU (U6.E1)
extRAM_nRAS: External Memory (U5.F8), MCU (U6.D2)
extRAM_nWE: External Memory (U5.F9), MCU (U6.D1)
IMU_INT1: MCU (U6.M14), Communication (U10.4)
IMU_INT2: MCU (U6.H10), Communication (U10.9)
IMU_MISO: MCU (U6.K1), Communication (U10.1)
IMU_MOSI: MCU (U6.J1), Communication (U10.14)
IMU_nCS: MCU (U6.B12), Communication (R23.1 U10.12)
IMU_SCLK: MCU (U6.J4), Communication (U10.13)
IO1: Top_Level (J4.7), MCU (U6.E12)
IO2: Top_Level (J4.4), MCU (U6.D12)
IO3: Top_Level (J4.8), MCU (U6.C12)
USB_DETECT: MCU (U6.N6), USB_AND_POWER (C13.2 U3.4)
USB_INTB: MCU (U6.H2), USB_AND_POWER (R2.1 U1.A1)
USB_MCU_N: MCU (U6.M8), USB_AND_POWER (U1.E1)
USB_MCU_P: MCU (U6.L8), USB_AND_POWER (U1.E2)
USB_SCL: MCU (U6.J11), USB_AND_POWER (R3.1 U1.B2)
USB_SDA: MCU (U6.K11), USB_AND_POWER (R4.1 U1.B3)

## Assembly variants
V0.0.0: not fitted C11 C14 C99 C100 FB6 FB10 FB12 FB14 R9 R12 R13 R14 R15 SW1